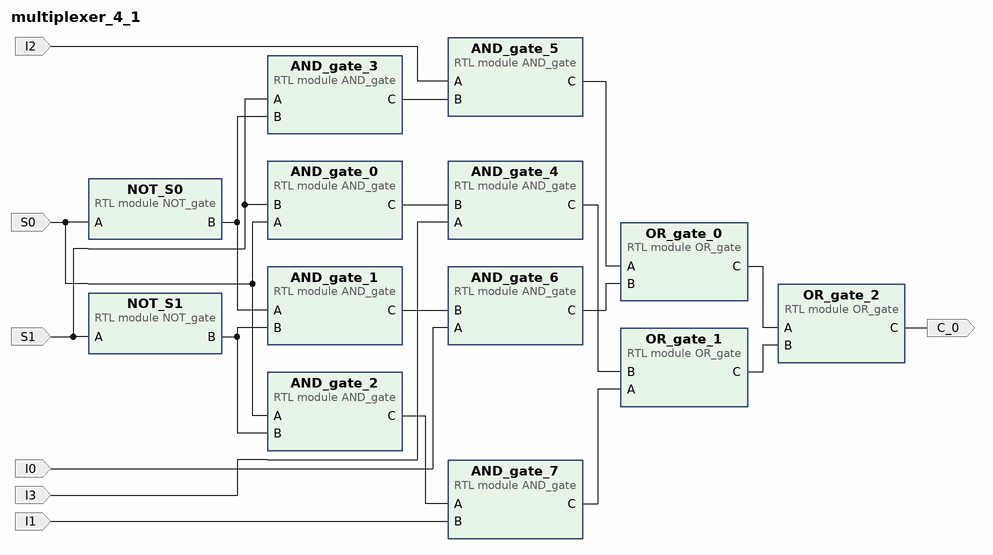
[diagram p0: block diagram of the top level]
# Vivado block design multiplexer_4_1, xc7z020clg400-1, Vivado 2023.2
create_bd_design multiplexer_4_1

create_bd_port -dir I S0
create_bd_port -dir I S1
create_bd_port -dir I I3
create_bd_port -dir I I2
create_bd_port -dir I I0
create_bd_port -dir I I1
create_bd_port -dir O C_0

create_bd_cell -type module -reference AND_gate AND_gate_0
create_bd_cell -type module -reference NOT_gate NOT_S0
create_bd_cell -type module -reference NOT_gate NOT_S1
create_bd_cell -type module -reference AND_gate AND_gate_1
create_bd_cell -type module -reference AND_gate AND_gate_2
create_bd_cell -type module -reference AND_gate AND_gate_3
create_bd_cell -type module -reference AND_gate AND_gate_4
create_bd_cell -type module -reference AND_gate AND_gate_5
create_bd_cell -type module -reference AND_gate AND_gate_6
create_bd_cell -type module -reference AND_gate AND_gate_7
create_bd_cell -type module -reference OR_gate OR_gate_0
create_bd_cell -type module -reference OR_gate OR_gate_1
create_bd_cell -type module -reference OR_gate OR_gate_2

# ---- connections ----

connect_bd_net [get_bd_pins AND_gate_0/C] [get_bd_pins AND_gate_4/B]
connect_bd_net [get_bd_pins AND_gate_1/C] [get_bd_pins AND_gate_6/B]
connect_bd_net [get_bd_pins AND_gate_2/C] [get_bd_pins AND_gate_7/A]
connect_bd_net [get_bd_pins AND_gate_3/C] [get_bd_pins AND_gate_5/B]
connect_bd_net [get_bd_pins AND_gate_4/C] [get_bd_pins OR_gate_1/B]
connect_bd_net [get_bd_pins AND_gate_5/C] [get_bd_pins OR_gate_0/A]
connect_bd_net [get_bd_pins AND_gate_6/C] [get_bd_pins OR_gate_0/B]
connect_bd_net [get_bd_pins AND_gate_7/C] [get_bd_pins OR_gate_1/A]
connect_bd_net -net A_0_1 [get_bd_ports S0] [get_bd_pins AND_gate_0/A] [get_bd_pins AND_gate_2/A] [get_bd_pins NOT_S0/A]
connect_bd_net -net A_0_2 [get_bd_ports I0] [get_bd_pins AND_gate_6/A]
connect_bd_net -net A_1_1 [get_bd_ports I3] [get_bd_pins AND_gate_4/A]
connect_bd_net -net A_1_2 [get_bd_ports I2] [get_bd_pins AND_gate_5/A]
connect_bd_net -net B_0_1 [get_bd_ports S1] [get_bd_pins AND_gate_0/B] [get_bd_pins AND_gate_3/A] [get_bd_pins NOT_S1/A]
connect_bd_net -net B_0_2 [get_bd_ports I1] [get_bd_pins AND_gate_7/B]
connect_bd_net -net NOT_gate_0_B [get_bd_pins NOT_S0/B] [get_bd_pins AND_gate_1/A] [get_bd_pins AND_gate_3/B]
connect_bd_net -net NOT_gate_1_B [get_bd_pins NOT_S1/B] [get_bd_pins AND_gate_1/B] [get_bd_pins AND_gate_2/B]
connect_bd_net [get_bd_pins OR_gate_0/C] [get_bd_pins OR_gate_2/A]
connect_bd_net [get_bd_pins OR_gate_1/C] [get_bd_pins OR_gate_2/B]
connect_bd_net [get_bd_pins OR_gate_2/C] [get_bd_ports C_0]

validate_bd_design
save_bd_design
